# Altium schematic sheet Vl822.SchDoc
size A3; SheetNumber: 4; SheetTotal: 4
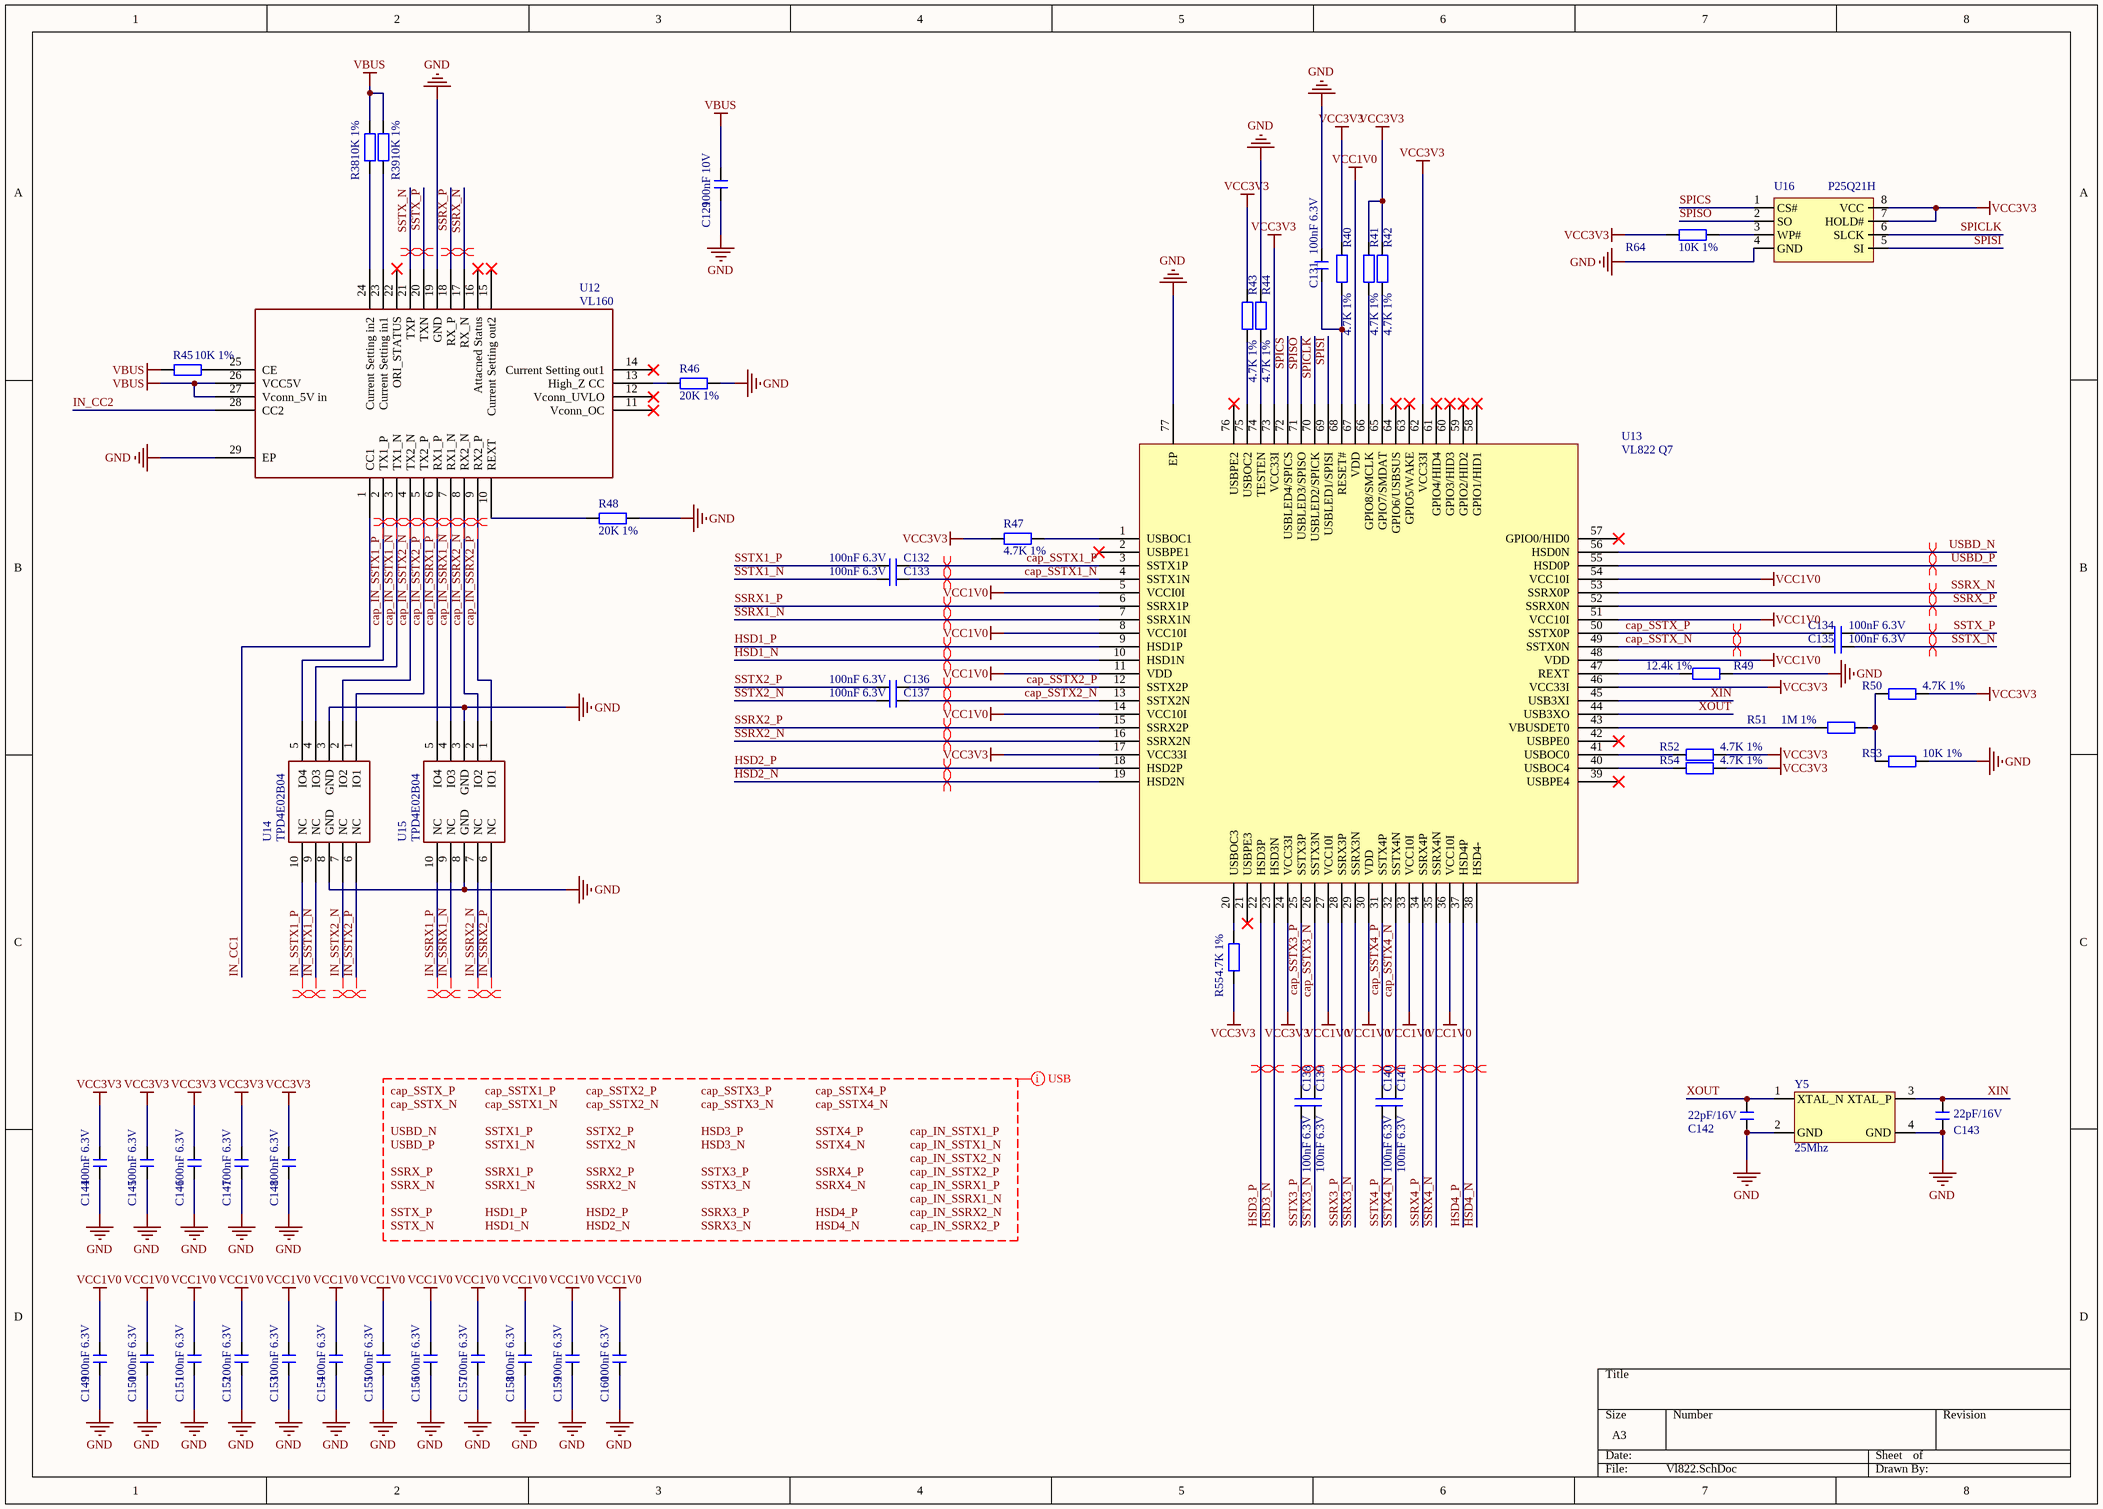
[diagram p0: Vl822.SchDoc]

## Parts
C129  100nF 10V  [C0402_L]
C131  100nF 6.3V  [C0402_L]
C132  100nF 6.3V  [C0402_L]
C133  100nF 6.3V  [C0402_L]
C134  100nF 6.3V  [C0402_L]
C135  100nF 6.3V  [C0402_L]
C136  100nF 6.3V  [C0402_L]
C137  100nF 6.3V  [C0402_L]
C138  100nF 6.3V  [C0402_L]
C139  100nF 6.3V  [C0402_L]
C140  100nF 6.3V  [C0402_L]
C141  100nF 6.3V  [C0402_L]
C142  22pF/16V  [C0402_L]
C143  22pF/16V  [C0402_L]
C144  100nF 6.3V  [C0402_L]
C145  100nF 6.3V  [C0402_L]
C146  100nF 6.3V  [C0402_L]
C147  100nF 6.3V  [C0402_L]
C148  100nF 6.3V  [C0402_L]
C149  100nF 6.3V  [C0402_L]
C150  100nF 6.3V  [C0402_L]
C151  100nF 6.3V  [C0402_L]
C152  100nF 6.3V  [C0402_L]
C153  100nF 6.3V  [C0402_L]
C154  100nF 6.3V  [C0402_L]
C155  100nF 6.3V  [C0402_L]
C156  100nF 6.3V  [C0402_L]
C157  100nF 6.3V  [C0402_L]
C158  100nF 6.3V  [C0402_L]
C159  100nF 6.3V  [C0402_L]
C160  100nF 6.3V  [C0402_L]
R38  10K 1%  [R0402_L]
R39  10K 1%  [R0402_L]
R40  4.7K 1%  [R0402_L]
R41  4.7K 1%  [R0402_L]
R42  4.7K 1%  [R0402_L]
R43  4.7K 1%  [R0402_L]
R44  4.7K 1%  [R0402_L]
R45  10K 1%  [R0402_L]
R46  20K 1%  [R0402_L]
R47  4.7K 1%  [R0402_L]
R48  20K 1%  [R0402_L]
R49  12.4k 1%  [R0402_L]
R50  4.7K 1%  [R0402_L]
R51  1M 1%  [R0402_L]
R52  4.7K 1%  [R0402_L]
R53  10K 1%  [R0402_L]
R54  4.7K 1%  [R0402_L]
R55  4.7K 1%  [R0402_L]
R64  10K 1%  [R0402_L]
U12  VL160  [MQFN-28_L4.5-W3.5-P0.40-BL-EP]
U13  VL822 Q7  [QFN-76_L9.0-W9.0-P0.40-EP6.3-TL]
U14  TPD4E02B04  [DIO_TPD4E02B04DQAR]
U15  TPD4E02B04  [DIO_TPD4E02B04DQAR]
U16  P25Q21H  [SOP8_L]
Y5  25Mhz  [OSC 3225-4P]

## Nets
GND: C129.1 C131.2 C142.2 C143.2 C144.1 C145.1 C146.1 C147.1 C148.1 C149.1 C150.1 C151.1 C152.1 C153.1 C154.1 C155.1 C156.1 C157.1 C158.1 C159.1 C160.1 R44.2 R46.1 R48.1 R49.2 R53.2 U12.19(GND) U12.29(EP) U13.77(EP) U14.3(GND) U14.8(GND) U15.3(GND) U15.8(GND) U16.4(GND) Y5.2(GND) Y5.4(GND)
VBUS: C129.2 R38.1 R39.1 R45.2 U12.26(VCC5V) U12.27(Vconn_5V_in)
VCC1V0: C149.2 C150.2 C151.2 C152.2 C153.2 C154.2 C155.2 C156.2 C157.2 C158.2 C159.2 C160.2 U13.5(VCCI0I) U13.8(VCC10I) U13.11(VDD) U13.14(VCC10I) U13.27(VCC10I) U13.30(VDD) U13.33(VCC10I) U13.36(VCC10I) U13.48(VDD) U13.51(VCC10I) U13.54(VCC10I) U13.67(VDD)
VCC3V3: C144.2 C145.2 C146.2 C147.2 C148.2 R40.2 R41.2 R42.2 R43.2 R47.2 R50.2 R52.2 R54.2 R55.2 R64.2 U13.17(VCC33I) U13.24(VCC33I) U13.46(VCC33I) U13.62(VCC33I) U13.73(VCC33I) U16.7(HOLD#) U16.8(VCC)
cap_IN_SSRX1_N: U12.7(RX1_N) U15.4(IO3)
cap_IN_SSRX1_P: U12.6(RX1_P) U15.5(IO4)
cap_IN_SSRX2_N: U12.8(RX2_N) U15.2(IO2)
cap_IN_SSRX2_P: U12.9(RX2_P) U15.1(IO1)
cap_IN_SSTX1_N: U12.3(TX1_N) U14.4(IO3)
cap_IN_SSTX1_P: U12.2(TX1_P) U14.5(IO4)
cap_IN_SSTX2_N: U12.4(TX2_N) U14.2(IO2)
cap_IN_SSTX2_P: U12.5(TX2_P) U14.1(IO1)
cap_SSTX1_N: C133.2 U13.4(SSTX1N)
cap_SSTX1_P: C132.2 U13.3(SSTX1P)
cap_SSTX2_N: C137.2 U13.13(SSTX2N)
cap_SSTX2_P: C136.2 U13.12(SSTX2P)
cap_SSTX3_N: C139.2 U13.26(SSTX3N)
cap_SSTX3_P: C138.2 U13.25(SSTX3P)
cap_SSTX4_N: C141.2 U13.32(SSTX4N)
cap_SSTX4_P: C140.2 U13.31(SSTX4P)
cap_SSTX_N: C135.2 U13.49(SSTX0N)
cap_SSTX_P: C134.2 U13.50(SSTX0P)
HSD1_N: U13.10(HSD1N)
HSD1_P: U13.9(HSD1P)
HSD2_N: U13.19(HSD2N)
HSD2_P: U13.18(HSD2P)
HSD3_N: U13.23(HSD3N)
HSD3_P: U13.22(HSD3P)
HSD4_N: U13.38(HSD4-)
HSD4_P: U13.37(HSD4P)
IN_CC1: U12.1(CC1)
IN_CC2: U12.28(CC2)
IN_SSRX1_N: U15.9(NC)
IN_SSRX1_P: U15.10(NC)
IN_SSRX2_N: U15.7(NC)
IN_SSRX2_P: U15.6(NC)
IN_SSTX1_N: U14.9(NC)
IN_SSTX1_P: U14.10(NC)
IN_SSTX2_N: U14.7(NC)
IN_SSTX2_P: U14.6(NC)
SPICLK: U13.70(USBLED2/SPICK) U16.6(SLCK)
SPICS: U13.72(USBLED4/SPICS) U16.1(CS#)
SPISI: U13.69(USBLED1/SPISI) U16.5(SI)
SPISO: U13.71(USBLED3/SPISO) U16.2(SO)
SSRX1_N: U13.7(SSRX1N)
SSRX1_P: U13.6(SSRX1P)
SSRX2_N: U13.16(SSRX2N)
SSRX2_P: U13.15(SSRX2P)
SSRX3_N: U13.29(SSRX3N)
SSRX3_P: U13.28(SSRX3P)
SSRX4_N: U13.35(SSRX4N)
SSRX4_P: U13.34(SSRX4P)
SSRX_N: U12.17(RX_N) U13.53(SSRX0P)
SSRX_P: U12.18(RX_P) U13.52(SSRX0N)
SSTX1_N: C133.1
SSTX1_P: C132.1
SSTX2_N: C137.1
SSTX2_P: C136.1
SSTX3_N: C139.1
SSTX3_P: C138.1
SSTX4_N: C141.1
SSTX4_P: C140.1
SSTX_N: C135.1 U12.21(TXP)
SSTX_P: C134.1 U12.20(TXN)
USBD_N: U13.56(HSD0N)
USBD_P: U13.55(HSD0P)
XIN: C143.1 U13.45(USB3XI) Y5.3(XTAL_P)
XOUT: C142.1 U13.44(USB3XO) Y5.1(XTAL_N)
NetC131_1: C131.1 R40.1 U13.68(RESET#)
NetR38_2: R38.2 U12.24(Current_Setting_in2)
NetR39_2: R39.2 U12.23(Current_Setting_in1)
NetR41_1: R41.1 U13.66(GPIO8/SMCLK)
NetR42_1: R42.1 U13.65(GPIO7/SMDAT)
NetR43_1: R43.1 U13.75(USBOC2)
NetR44_1: R44.1 U13.74(TESTEN)
NetR45_1: R45.1 U12.25(CE)
NetR46_2: R46.2 U12.13(High_Z_CC)
NetR47_1: R47.1 U13.1(USBOC1)
NetR48_2: R48.2 U12.10(REXT)
NetR49_1: R49.1 U13.47(REXT)
NetR50_1: R50.1 R51.2 R53.1
NetR51_1: R51.1 U13.43(VBUSDET0)
NetR52_1: R52.1 U13.41(USBOC0)
NetR54_1: R54.1 U13.40(USBOC4)
NetR55_1: R55.1 U13.20(USBOC3)
NetR64_1: R64.1 U16.3(WP#)

Not connected (* = marked no-connect by the designer): U12 11(Vconn_OC)* 12(Vconn_UVLO)* 14(Current_Setting_out1)* 15(Current_Setting_out2)* 16(Attacned_Status)* 22(ORI_STATUS)*; U13 2(USBPE1)* 21(USBPE3)* 39(USBPE4)* 42(USBPE0)* 57(GPIO0/HID0)* 58(GPIO1/HID1)* 59(GPIO2/HID2)* 60(GPIO3/HID3)* 61(GPIO4/HID4)* 63(GPIO5/WAKE)* 64(GPIO6/USBSUS)* 76(USBPE2)*

## Layout directives
differential pair: cap_IN_SSRX1_N, cap_IN_SSRX1_P, cap_IN_SSRX2_N, cap_IN_SSRX2_P, cap_IN_SSTX1_N, cap_IN_SSTX1_P, cap_IN_SSTX2_N, cap_IN_SSTX2_P, cap_SSTX1_N, cap_SSTX1_P, cap_SSTX2_N, cap_SSTX2_P, cap_SSTX3_N, cap_SSTX3_P, cap_SSTX4_N, cap_SSTX4_P, cap_SSTX_N, cap_SSTX_P, HSD1_N, HSD1_P, HSD2_N, HSD2_P, HSD3_N, HSD3_P, HSD4_N, HSD4_P, IN_SSRX1_N, IN_SSRX1_P, IN_SSRX2_N, IN_SSRX2_P, IN_SSTX1_N, IN_SSTX1_P, IN_SSTX2_N, IN_SSTX2_P, SSRX1_N, SSRX1_P, SSRX2_N, SSRX2_P, SSRX3_N, SSRX3_P, SSRX4_N, SSRX4_P, SSRX_N, SSRX_P, SSTX_N, SSTX_P, USBD_N, USBD_P
net class USB; rule Differential Pairs Routing [Pref Gap = 4mil    Min Gap  = 4mil    Max Gap  = 4milPref Width = 5.15mil    Min Width  = 5.15mil    Max Width  = 5.15mil]: cap_IN_SSRX1_N, cap_IN_SSRX1_P, cap_IN_SSRX2_N, cap_IN_SSRX2_P, cap_IN_SSTX1_N, cap_IN_SSTX1_P, cap_IN_SSTX2_N, cap_IN_SSTX2_P, cap_SSTX1_N, cap_SSTX1_P, cap_SSTX2_N, cap_SSTX2_P, cap_SSTX3_N, cap_SSTX3_P, cap_SSTX4_N, cap_SSTX4_P, cap_SSTX_N, cap_SSTX_P, HSD1_N, HSD1_P, HSD2_N, HSD2_P, HSD3_N, HSD3_P, HSD4_N, HSD4_P, SSRX1_N, SSRX1_P, SSRX2_N, SSRX2_P, SSRX3_N, SSRX3_P, SSRX4_N, SSRX4_P, SSRX_N, SSRX_P, SSTX1_N, SSTX1_P, SSTX2_N, SSTX2_P, SSTX3_N, SSTX3_P, SSTX4_N, SSTX4_P, SSTX_N, SSTX_P, USBD_N, USBD_P

## Notes on the sheet
- Labels drawn without touching a wire or pin: cap_IN_SSRX1_N, cap_IN_SSRX1_P, cap_IN_SSRX2_N, cap_IN_SSRX2_P, cap_IN_SSTX1_N, cap_IN_SSTX1_P, cap_IN_SSTX2_N, cap_IN_SSTX2_P, cap_SSTX1_N, cap_SSTX1_P, cap_SSTX2_N, cap_SSTX2_P, cap_SSTX3_N, cap_SSTX3_P, cap_SSTX4_N, cap_SSTX4_P, cap_SSTX_N, cap_SSTX_P, HSD1_N, HSD1_P, HSD2_N, HSD2_P, HSD3_N, HSD3_P, HSD4_N, HSD4_P, SSRX1_N, SSRX1_P, SSRX2_N, SSRX2_P, SSRX3_N, SSRX3_P, SSRX4_N, SSRX4_P, SSRX_N, SSRX_P, SSTX1_N, SSTX1_P, SSTX2_N, SSTX2_P, SSTX3_N, SSTX3_P, SSTX4_N, SSTX4_P, SSTX_N, SSTX_P, USBD_N, USBD_P

## Library data of the parts
C129 C131-C160 = C: 无极性贴片电容; 版权归属: 源创客; 材质: X7R; BOM名称: 无极性贴片电容; 学习资源: www.ooocke.com
R38-R55 R64 = R: 贴片电阻; 版权归属: 源创客; BOM名称: 贴片电阻; 学习资源: www.ooocke.com
U14 U15 = TPD4E02B04: ESD
U16 = P25D40H
Y5 = Crystal